# EAGLE board ARKnew (EAGLE 9.4.2)
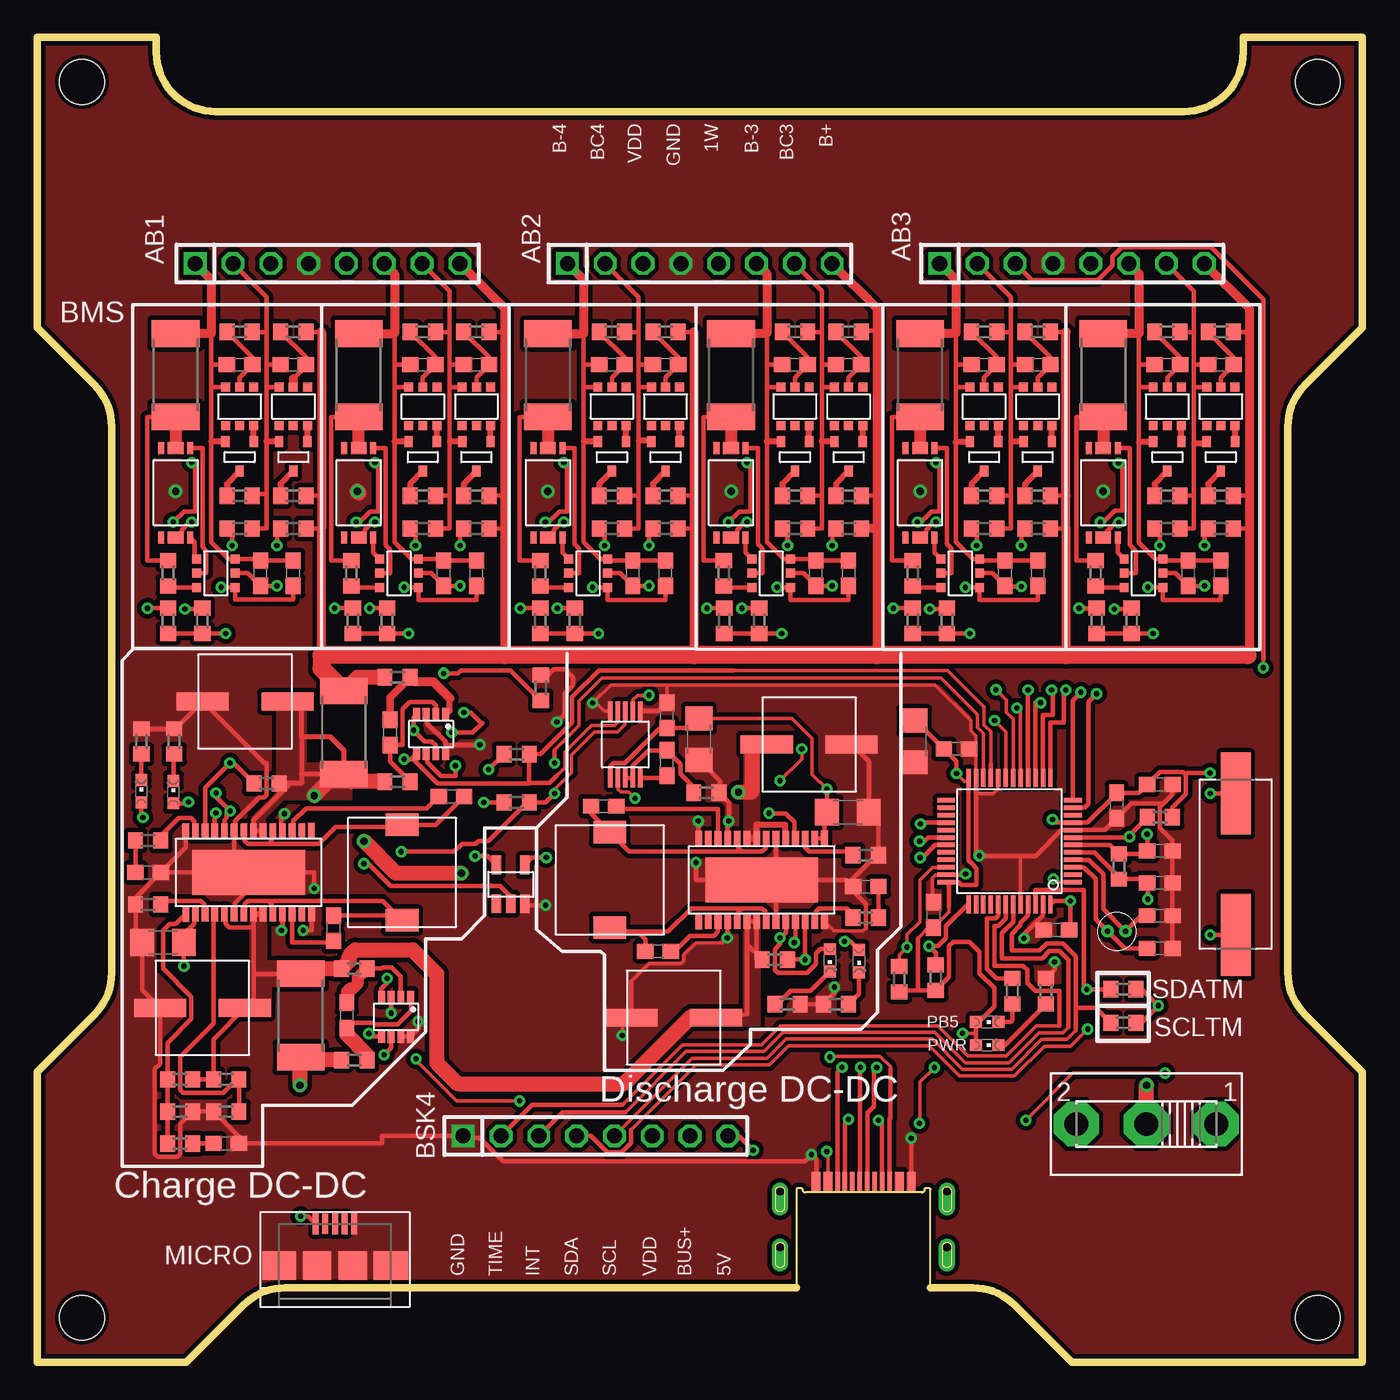
[diagram p2: board, top side]
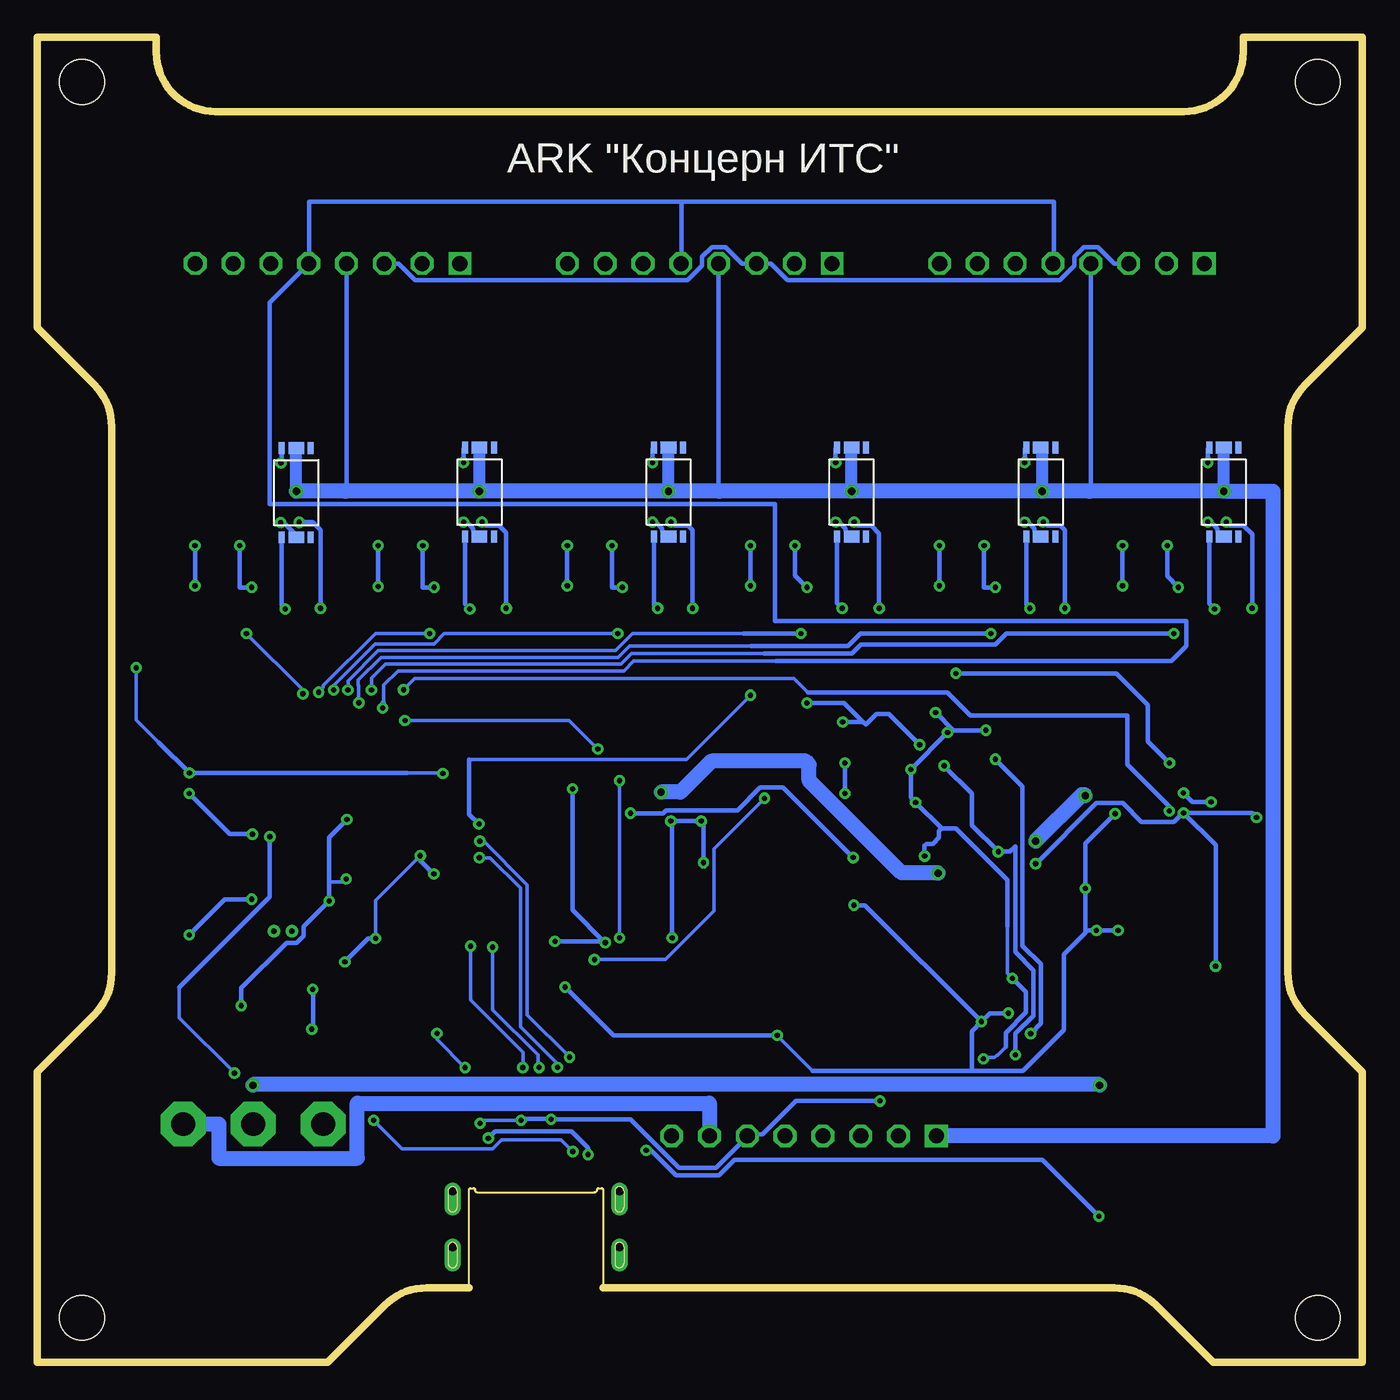
[diagram p3: board, bottom side, seen from below]

Size 89 x 89 mm. Coordinates in mm from the lower left corner, seen from the top.
Outline: 51,5 16.66,5 arc45 13.83,3.83 10,0 0,0 0,19.5 3.83,23.33 arc45 5,26.16 5,62.84 arc45 3.83,65.67 0,69.5 0,89 8,89 8,88 arc90 12,84 77,84 arc90 81,88 81,89 89,89 89,69.5 85.17,65.67 arc45 84,62.84 84,26.16 arc45 85.17,23.33 89,19.5 89,0 69.5,0 65.67,3.83 arc45 62.84,5 60,5
Copper layers (1*16): Top 0.035mm / dielectric 1.5mm / Bottom 0.035mm
Design rules "default *": minimum track width 0.25mm, minimum drill 0.35mm, track to track 0.2mm, track to pad 0.2mm, pad to pad 0.2mm, via to via 0.2mm, smd to smd 0.2mm, copper to edge 0.25mm, drill to drill 0.1mm, minimum pad ring 10mil, minimum via ring 8mil, stop-mask expansion 2mil, vias tented up to drill 0mil, thermal gap 10mil
Holes 3 mm at 3,3 86,3 86,86 3,86

## Footprints (pad centres in the part's own frame; a part is rotated, then mirrored left to right if it is on the bottom)
B82472G6 = smd 1.5 x 2.2: 1 -3.2,0; 2 3.2,0
1X08 = drill 1.016 square: 1 -8.89,0 | drill 1.016 octagon: 2 -6.35,0; 3 -3.81,0; 4 -1.27,0; 5 1.27,0; 6 3.81,0; 7 6.35,0; 8 8.89,0
AD5272 = smd 0.3 x 1.275: 1 -1,-2.24; 2 -0.5,-2.24; 3 0,-2.24; 4 0.5,-2.24; 5 1,-2.24; 6 1,2.24; 7 0.5,2.24; 8 0,2.24; 9 -0.5,2.24; 10 -1,2.24
C0603 = smd 1.1 x 1: 1 -0.85,0; 2 0.85,0
C005R = drill 0.35 pad 0.85: P$1 0,0.6; P$2 0,-0.6
C1206 = smd 1.6 x 1.8: 1 -1.4,0; 2 1.4,0
ECAP150 = smd 1.2 x 3.5: P$1 0,2.85; P$2 0,-2.85
ECAP220 = smd 1.2 x 3.5: P$1 0,2.85; P$2 0,-2.85
LQFP48 = smd 0.3 x 1.2: 1 -2.75,-4.25; 2 -2.25,-4.25; 3 -1.75,-4.25; 4 -1.25,-4.25; 5 -0.75,-4.25; 6 -0.25,-4.25; 7 0.25,-4.25; 8 0.75,-4.25; 9 1.25,-4.25; 10 1.75,-4.25; 11 2.25,-4.25; 12 2.75,-4.25; 25 2.75,4.25; 26 2.25,4.25; 27 1.75,4.25; 28 1.25,4.25; 29 0.75,4.25; 30 0.25,4.25; 31 -0.25,4.25; 32 -0.75,4.25; 33 -1.25,4.25; 34 -1.75,4.25; 35 -2.25,4.25; 36 -2.75,4.25 | smd 1.2 x 0.3: 13 4.25,-2.75; 14 4.25,-2.25; 15 4.25,-1.75; 16 4.25,-1.25; 17 4.25,-0.75; 18 4.25,-0.25; 19 4.25,0.25; 20 4.25,0.75; 21 4.25,1.25; 22 4.25,1.75; 23 4.25,2.25; 24 4.25,2.75; 37 -4.25,2.75; 38 -4.25,2.25; 39 -4.25,1.75; 40 -4.25,1.25; 41 -4.25,0.75; 42 -4.25,0.25; 43 -4.25,-0.25; 44 -4.25,-0.75; 45 -4.25,-1.25; 46 -4.25,-1.75; 47 -4.25,-2.25; 48 -4.25,-2.75
INA219AID = smd 0.9 x 0.45: 1 -1.3,0.975; 2 -1.3,0.325; 3 -1.3,-0.325; 4 -1.3,-0.975; 5 1.3,-0.975; 6 1.3,-0.325; 7 1.3,0.325; 8 1.3,0.975
CHIPLED_0603 = smd 0.8 x 0.8: A 0,-0.75; C 0,0.75
629105136821 = smd 0.4 x 1.4: 5V -1.3,0; D+ 0,0; GND 1.3,0; SENSE 0.65,0 | smd 0.4 x 1.35: D- -0.65,0 | smd 2.3 x 1.9: Z1 -3.75,-2.8; Z4 3.75,-2.8 | smd 1.9 x 1.9: Z2 -1.2,-2.8; Z3 1.2,-2.8
XTAL_9C-8.000MEEJ-T = smd 5.5 x 2: 1 -4.75,0; 2 4.75,0
R0603 = smd 1 x 1.1: 1 -0.85,0; 2 0.85,0
R2512 = smd 1.8 x 3.2: 1 -2.8,0; 2 2.8,0
UNICS-SWITCH = drill 1.6 pad 3 octagon: 1 -4.7,0; 2 0,0; 3 4.7,0
FS8205A- = smd 0.4 x 0.8: 1 -0.975,-3; 4 0.975,-3; 5 0.975,3; 8 -0.975,3 | smd 1.05 x 0.8: 23 0,-3; 67 0,3
INVERTER = smd 0.635 x 1.27: P$1 -0.95,-1.3; P$2 0,-1.3; P$3 0.95,-1.3; P$4 0.95,1.3; P$5 -0.95,1.3
HY2120 = smd 0.6 x 0.6: 1 -0.95,-1.3; 2 0,-1.3; 3 0.95,-1.3; 4 0.95,1.3; 5 0,1.3; 6 -0.95,1.3
HY2213 = smd 0.6 x 0.6: 1 -0.95,-1.3; 2 0,-1.3; 3 0.95,-1.3; 4 0.95,1.3; 5 0,1.3; 6 -0.95,1.3
SI2302CDS = smd 0.56 x 0.73: 1 -0.95,-1; 2 0.95,-1; 3 0,1
LTC3119 = smd 0.45 x 1.05: 1 -4.225,-2.775; 2 -3.575,-2.775; 3 -2.925,-2.775; 4 -2.275,-2.775; 5 -1.625,-2.775; 6 -0.975,-2.775; 7 -0.325,-2.775; 8 0.325,-2.775; 9 0.975,-2.775; 10 1.625,-2.775; 11 2.275,-2.775; 12 2.925,-2.775; 13 3.575,-2.775; 14 4.225,-2.775; 15 4.225,2.775; 16 3.575,2.775; 17 2.925,2.775; 18 2.275,2.775; 19 1.625,2.775; 20 0.975,2.775; 21 0.325,2.775; 22 -0.325,2.775; 23 -0.975,2.775; 24 -1.625,2.775; 25 -2.275,2.775; 26 -2.925,2.775; 27 -3.575,2.775; 28 -4.225,2.775 | smd 7.56 x 3.05: 29 0,0
USB-C = smd 0.3 x 1.4: 3V3/BUS0 -1.25,7.1; 3V3/BUS1 1.25,7.1; NC/3V3 -0.75,7.1; NC/M1 0.75,7.1; RX0 -1.75,7.1; SWC/TXD 0.25,7.1; SWD/RXD -0.25,7.1; TX0 1.75,7.1 | smd 0.6 x 1.4: GND0 -3.2,7.1; GND1 3.2,7.1; NC/GPIO 2.4,7.1; NRST/EN -2.4,7.1 | drill 0.6 pad 1.1 offset: P$13 -5.6,6.5; P$14 -5.6,2.75; P$15 5.6,6.5; P$16 5.6,2.75

## Placement (x,y rotation side)
3,3µH  3,3µ  [B82472G6]  24.5,32.9 270 top
3,3µH1  3,3µ  [B82472G6]  38.45,32.4 90 top
AB1  [1X08]  19.5,73.8 0 top
AB2  [1X08]  44.5,73.8 0 top
AB3  [1X08]  69.5,73.8 0 top
AD5272#2  AD5272  [AD5272]  39.5,41.5 0 top
BSK4  [1X08]  37.5,15.2 0 top
C1  0,1µ  [C0603]  27.3,53 90 top
C2  0,1µ  [C0603]  29.5,53 90 top
C3  0,1µ  [C0603]  29.5,67 180 top
C4  0,1µ  [C0603]  25.9,67 180 top
C5  0,1µ  [C0603]  52.3,53 90 top
C005R  32,768KHz  [C005R]  72.5,28.95 90 top
C6  0,1µ  [C0603]  54.5,53 90 top
C7  0,1µ  [C0603]  54.5,67 180 top
C8  0,1µ  [C0603]  50.9,67 180 top
C9  0,1µ  [C0603]  77.3,53 90 top
C10  0,1µ  [C0603]  79.5,53 90 top
C11  0,1µ  [C0603]  79.5,67 180 top
C12  0,1µ  [C0603]  75.9,67 180 top
C13  0,1µ  [C0603]  38.05,37.35 0 top
C14  0,1µ  [C0603]  41.7,27.6 0 top
C15  100nF  [C0603]  61.75,41.2 0 top
C16  10µ  [C1206]  58.9,41.7 270 top
C17  0,1µ  [C0603]  65,53 90 top
C18  0,1µ  [C0603]  67.2,53 90 top
C19  0,1µ  [C0603]  67.2,67 180 top
C20  0,1µ  [C0603]  63.6,67 180 top
C21  0,1µ  [C0603]  40,53 90 top
C22  0,1µ  [C0603]  42.2,53 90 top
C23  0,1µ  [C0603]  42.2,67 180 top
C24  0,1µ  [C0603]  38.6,67 180 top
C25  0,1µ  [C0603]  15,53 90 top
C26  0,1µ  [C0603]  17.2,53 90 top
C27  0,1µ  [C0603]  17.2,67 180 top
C28  0,1µ  [C0603]  13.6,67 180 top
C29  1µ  [C0603]  42.3,40.25 90 top
C30  680p  [C0603]  55.65,31.95 180 top
C31  4.7µ  [C1206]  54.45,36.95 0 top
C33  0,1µ  [C0603]  19.9,29.15 270 top
C34  0,1µ  [C0603]  27.82,38.01 180 top
C35  150µ  [ECAP150]  13.96,44.38 270 top
C36  680p  [C0603]  7.45,32.9 0 top
C37  220µ  [ECAP220]  11.1,23.8 270 top
C38  3,3n  [C0603]  12.7,14.7 0 top
C39  4.7µ  [C1206]  8.45,28.2 180 top
C40  0,1µ  [C0603]  20.8,23.3 90 top
C41  0,1µ  [C0603]  23.7,42.3 270 top
C44  27pF  [C0603]  75.4,34.35 0 top
C45  27pF  [C0603]  75.4,32.2 0 top
C46  10pF  [C0603]  75.4,27.8 0 top
C47  10pF  [C0603]  75.4,30 0 top
C48  100nF  [C0603]  75.4,38.8 0 top
C49  150µ  [ECAP150]  42.75,23.15 270 top
C50  220µ  [ECAP220]  51.85,41.5 90 top
C51  0,1µ  [C0603]  42.3,43.45 90 top
C52  10µ  [C1206]  44.45,41.85 270 top
C53  100nF  [C0603]  68.45,29.05 180 top
C54  100nF  [C0603]  72.5,37.4 270 top
C55  100nF  [C0603]  60.2,30.05 90 top
IC2  STM32F103C8T  [LQFP48]  65.3,35 90 top
INA219#1  INA219AID  [INA219AID]  24.1,23.2 270 top
LED1  [CHIPLED_0603]  55.2,26.95 180 top
LED2  [CHIPLED_0603]  9.15,38.3 0 top
LED3  [CHIPLED_0603]  53.25,27 180 top
LED8  [CHIPLED_0603]  7,38.35 0 top
MICRO  629105136821  [629105136821]  20,9.3 0 top
PB5  [CHIPLED_0603]  63.8,22.85 270 top
PWR  [CHIPLED_0603]  63.8,21.3 270 top
Q5  8MHz  [XTAL_9C-8.000MEEJ-T]  80.5,33.45 270 top
R1  2k  [R0603]  21.1,53 90 top
R2  330R  [R0603]  29.5,56 0 top
R3  330R  [R0603]  25.9,56 0 top
R4  100R  [R0603]  29.5,58.2 0 top
R5  100R  [R0603]  25.9,58.2 0 top
R6  100R  [R0603]  29.5,69.2 0 top
R7  100R  [R0603]  25.9,69.2 0 top
R8  R05  [R2512]  21.6,66.3 90 top
R9  2k  [R0603]  46.1,53 90 top
R10  330R  [R0603]  54.5,56 0 top
R11  330R  [R0603]  50.9,56 0 top
R12  100R  [R0603]  54.5,58.2 0 top
R13  100R  [R0603]  50.9,58.2 0 top
R14  100R  [R0603]  54.5,69.2 0 top
R15  100R  [R0603]  50.9,69.2 0 top
R16  R05  [R2512]  46.6,66.3 90 top
R17  2k  [R0603]  71.1,53 90 top
R18  330R  [R0603]  79.5,56 0 top
R19  330R  [R0603]  75.9,56 0 top
R20  100R  [R0603]  79.5,58.2 0 top
R21  100R  [R0603]  75.9,58.2 0 top
R22  100R  [R0603]  79.5,69.2 0 top
R23  100R  [R0603]  75.9,69.2 0 top
R24  R05  [R2512]  71.6,66.3 90 top
R25  5k1  [R0603]  72.95,22.8 180 top
R26  5k1  [R0603]  72.95,25.05 180 top
R27  10k  [R0603]  60.35,25.83 90 top
R28  150k  [R0603]  55.65,34.05 180 top
R29  150k  [R0603]  55.65,29.85 0 top
R30  14K3  [R0603]  44.95,38.25 0 top
R31  2k  [R0603]  53.65,24.05 0 top
R32  2k  [R0603]  9.2,41.7 270 top
R33  2k  [R0603]  58.8,53 90 top
R34  330R  [R0603]  67.2,56 0 top
R35  330R  [R0603]  63.6,56 0 top
R36  100R  [R0603]  67.2,58.2 0 top
R37  100R  [R0603]  63.6,58.2 0 top
R38  100R  [R0603]  67.2,69.2 0 top
R39  100R  [R0603]  63.6,69.2 0 top
R40  R05  [R2512]  59.3,66.3 90 top
R41  2k  [R0603]  33.8,53 90 top
R42  330R  [R0603]  42.2,56 0 top
R43  330R  [R0603]  38.6,56 0 top
R44  100R  [R0603]  42.2,58.2 0 top
R45  100R  [R0603]  38.6,58.2 0 top
R46  100R  [R0603]  42.2,69.2 0 top
R47  100R  [R0603]  38.6,69.2 0 top
R48  R05  [R2512]  34.3,66.3 90 top
R49  2k  [R0603]  8.8,53 90 top
R50  330R  [R0603]  17.2,56 0 top
R51  330R  [R0603]  13.6,56 0 top
R52  100R  [R0603]  17.2,58.2 0 top
R53  100R  [R0603]  13.6,58.2 0 top
R54  100R  [R0603]  17.2,69.2 0 top
R55  100R  [R0603]  13.6,69.2 0 top
R56  R05  [R2512]  9.3,66.3 90 top
R57  2k  [R0603]  50.4,24.05 180 top
R61  91K  [R0603]  49.55,27.05 180 top
R62  232k  [R0603]  12.7,16.85 0 top
R64  10k  [R0603]  57.9,25.73 90 top
R65  1M  [R0603]  9.6,19 0 top
R66  10k  [R0603]  9.6,14.7 180 top
R67  150k  [R0603]  9.6,16.85 180 top
R68  150k  [R0603]  7.45,30.75 0 top
R69  150k  [R0603]  7.45,35.05 180 top
R70  24k3  [R0603]  33.82,45.31 90 top
R71  R01  [R2512]  17.7,23.3 270 top
R72  232k  [R0603]  15.41,38.88 0 top
R73  10R  [R0603]  21.3,20.3 0 top
R74  10R  [R0603]  21.3,26.45 0 top
R75  R01  [R2512]  20.6,42.3 90 top
R76  10R  [R0603]  24.2,46 0 top
R77  10R  [R0603]  24.2,39 0 top
R78  1M  [R0603]  72.65,33.3 270 top
R79  10k  [R0603]  75.4,36.6 180 top
R81  2k  [R0603]  65.5,24.93 270 top
R82  2k  [R0603]  67.75,24.93 270 top
R87  680k  [R0603]  12.7,19 180 top
R88  100R  [R0603]  58.8,49.8 90 top
R89  100R  [R0603]  61.1,49.8 90 top
R90  100R  [R0603]  71.15,49.8 90 top
R91  100R  [R0603]  73.5,49.8 90 top
R92  100R  [R0603]  46.15,49.8 90 top
R93  100R  [R0603]  48.5,49.8 90 top
R94  100R  [R0603]  21.2,49.8 90 top
R95  100R  [R0603]  23.5,49.8 90 top
R96  100R  [R0603]  33.8,49.8 90 top
R97  100R  [R0603]  36.1,49.8 90 top
R98  100R  [R0603]  8.8,49.8 90 top
R99  100R  [R0603]  11.1,49.8 90 top
R100  2k  [R0603]  7,41.7 270 top
R101  5k1  [R0603]  32.2,40.85 0 top
R102  5k1  [R0603]  32.2,37.6 0 top
S1  [UNICS-SWITCH]  74.5,16 180 top
U$1  FS8205A-  [FS8205A-]  9.3,58.4 0 top
U$2  INVERTER  [INVERTER]  31.8,32.1 0 top
U$3  HY2120  [HY2120]  24.3,53 270 top
U$4  HY2213  [HY2213]  29.5,64.2 180 top
U$5  HY2213  [HY2213]  25.9,64.2 180 top
U$6  SI2302CDS  [SI2302CDS]  29.5,60.85 180 top
U$7  SI2302CDS  [SI2302CDS]  25.9,60.85 180 top
U$8  FS8205A-  [FS8205A-]  34.3,58.4 0 top
U$9  FS8205A-  [FS8205A-]  71.6,58.41 180 bottom
U$10  HY2120  [HY2120]  49.3,53 270 top
U$11  HY2213  [HY2213]  54.5,64.2 180 top
U$12  HY2213  [HY2213]  50.9,64.2 180 top
U$13  SI2302CDS  [SI2302CDS]  54.5,60.85 180 top
U$14  SI2302CDS  [SI2302CDS]  50.9,60.85 180 top
U$15  FS8205A-  [FS8205A-]  59.3,58.4 0 top
U$16  LTC3119  [LTC3119]  48.65,32.4 0 top
U$17  HY2120  [HY2120]  74.3,53 270 top
U$18  HY2213  [HY2213]  79.5,64.2 180 top
U$19  HY2213  [HY2213]  75.9,64.2 180 top
U$20  SI2302CDS  [SI2302CDS]  79.5,60.85 180 top
U$21  SI2302CDS  [SI2302CDS]  75.9,60.85 180 top
U$22  FS8205A-  [FS8205A-]  59.3,58.45 180 bottom
U$23  USB-C  [USB-C]  55.5,5 0 top
U$24  FS8205A-  [FS8205A-]  71.6,58.4 0 top
U$25  FS8205A-  [FS8205A-]  46.6,58.4 0 top
U$26  FS8205A-  [FS8205A-]  21.6,58.4 0 top
U$27  FS8205A-  [FS8205A-]  46.6,58.45 180 bottom
U$28  FS8205A-  [FS8205A-]  34.3,58.45 180 bottom
U$29  FS8205A-  [FS8205A-]  21.6,58.45 180 bottom
U$30  FS8205A-  [FS8205A-]  9.3,58.45 180 bottom
U$31  HY2120  [HY2120]  62,53 270 top
U$32  HY2213  [HY2213]  67.2,64.2 180 top
U$33  HY2213  [HY2213]  63.6,64.2 180 top
U$34  SI2302CDS  [SI2302CDS]  67.2,60.85 180 top
U$35  SI2302CDS  [SI2302CDS]  63.6,60.85 180 top
U$38  HY2120  [HY2120]  37,53 270 top
U$39  HY2213  [HY2213]  42.2,64.2 180 top
U$40  HY2213  [HY2213]  38.6,64.2 180 top
U$41  SI2302CDS  [SI2302CDS]  42.2,60.85 180 top
U$42  SI2302CDS  [SI2302CDS]  38.6,60.85 180 top
U$45  HY2120  [HY2120]  12,53 270 top
U$46  HY2213  [HY2213]  17.2,64.2 180 top
U$47  HY2213  [HY2213]  13.6,64.2 180 top
U$48  SI2302CDS  [SI2302CDS]  17.2,60.85 180 top
U$49  SI2302CDS  [SI2302CDS]  13.6,60.85 180 top
U$57  INA219AID  [INA219AID]  26.45,42.2 270 top
U$59  LTC3119  [LTC3119]  14.2,32.9 180 top

## Tracks (layer width: path | path; a pad name or v marks a point on that pad's centre or on a via)
1W  (via drill 0.35)
  Top 0.25: v65.8,43.95 66.05,43.7 IC2.17
  Bottom 0.25: 39.37,47.1 48.95,47.1 49.6,46.45 64.75,46.45 65.72,45.48 65.72,44.32
  Bottom 0.3: 45.72,77.95 45.72,73.85 AB2.5 | 45.72,77.95 70.72,77.95 70.72,73.85 AB3.5 73.4,71.17 73.4,57.65 39.45,57.65 39.45,49.78 11.82,49.78 11.82,48.12 12.84,47.1 39.37,47.1 | 45.72,77.95 20.72,77.95 20.72,73.85 AB1.5 | v65.8,43.95 65.8,44.32 65.72,44.32
5V  (via drill 0.35)
  Top 0.3: BSK4.8 47.12,15.2 v48.09,14.23 | v17.7,9.8 18.2,9.8 MICRO.5V
  Bottom 0.3: v48.09,14.23 47.77,14.23 46.09,12.55 43.22,12.55 42.17,13.6 21.5,13.6 v17.7,9.8
90
  Top 0.3: R66.2 R67.2 R65.1 8.75,21.45 10.35,23.05 10.35,24.55 8.45,26.45 8.45,29 8.9,29.45 9.3,29.45 U$59.15
A  (via drill 0.35)
  Top 0.3: U$59.16 10.55,30.05 10.55,29.46 9.85,28.76 C39.1 v9.85,26.6 | U$59.11 11.93,36.82 v12,36.9 | v21.94,33.49 22.26,33.49 23.75,32 31.1,32 31.8,31.3 U$2.P$2 | v7.1,36.6 7,36.7 LED8.A
  Bottom 0.3: v12,36.9 9.85,34.75 v9.85,26.6 | v12,36.9 12.06,36.9 12.66,36.31 14.82,36.31 16.09,37.58 17.85,37.58 v21.94,33.49 | v12,36.9 7.4,36.9 v7.1,36.6
B-1
  Top 0.3: 24,69.1 24,67 | 24,67 24,65.5 | 24,65.5 24,61.85 24,55.1 25.15,53.95 U$3.6 27.2,53.95 C1.2 C2.2 | C4.2 24,67 | U$5.3 24,65.5
  Top 0.4: U$7.2 24,61.85
  Top 0.6: AB1.6 24,73.11 24,69.1 R8.2
B-2
  Top 0.3: 11.7,69.1 11.7,67 | 11.7,67 11.7,65.5 | 11.7,65.5 11.7,61.85 11.7,55.1 12.85,53.95 U$45.6 14.9,53.95 C25.2 C26.2 | 11.7,67 C28.2 | U$47.3 11.7,65.5
  Top 0.4: U$49.2 11.7,61.85
  Top 0.6: AB1.1 11.7,72.71 11.7,69.1 R56.2
B-3
  Top 0.3: 49,69.1 49,67 | C8.2 49,67 | 49,67 49,65.5 | 49,65.5 U$12.3 | 49,65.5 49,61.85 49,55.1 50.15,53.95 U$10.6 52.2,53.95 C5.2 C6.2
  Top 0.4: U$14.2 49,61.85
  Top 0.6: AB2.6 49,73.11 49,69.1 R16.2
B-4
  Top 0.3: 36.7,69.1 36.7,67 | 36.7,67 36.7,65.5 | 36.7,65.5 36.7,61.85 36.7,55.1 37.85,53.95 U$38.6 38.4,53.85 C21.2 C22.2 | C24.2 36.7,67 | U$40.3 36.7,65.5
  Top 0.4: U$42.2 36.7,61.85
  Top 0.6: AB2.1 36.7,72.71 36.7,69.1 R48.2
B-5
  Top 0.3: 74,69.1 74,67 | C12.2 74,67 | 74,67 74,65.5 | 74,65.5 U$19.3 | 74,65.5 74,61.8 74,55.05 75.1,53.95 U$17.6 75.6,53.85 C9.2 C10.2
  Top 0.4: U$21.2 74.9,61.8 74,61.8
  Top 0.6: AB3.6 74,73.11 74,69.1 R24.2
B-6
  Top 0.3: 61.7,69.1 61.7,67 | 61.7,67 C20.2 | 61.7,67 61.7,65.5 | 61.7,65.5 U$33.3 | 61.7,65.5 61.7,61.8 61.7,55.1 62.85,53.95 U$31.6 63.3,53.85 C17.2 C18.2
  Top 0.4: U$35.2 62.6,61.8 61.7,61.8
  Top 0.6: AB3.1 61.7,72.71 61.7,69.1 R40.2
BMS1  (via drill 0.35)
  Top 0.3: R94.1 R95.1 v24.95,48.95 | IC2.15 67.05,44.3 v67.4,44.3
  Bottom 0.25: 41.05,48.1 49.22,48.1 49.97,47.35 65.92,47.35 67.43,45.83 67.43,45.45 67.42,45.44 67.42,44.33 v67.4,44.3
  Bottom 0.3: v24.95,48.95 33.7,48.95 34.55,48.1 41.05,48.1
BMS2  (via drill 0.35)
  Top 0.3: R98.1 R99.1 v12.65,48.95 | IC2.16 v66.55,45.15
  Bottom 0.25: 40.2,47.6 49.08,47.6 49.79,46.9 65.6,46.9 66.55,45.95 v66.55,45.15
  Bottom 0.3: v12.65,48.95 23.92,48.95 24.65,48.22 33.67,48.22 34.29,47.6 40.2,47.6
BMS3  (via drill 0.35)
  Top 0.3: R92.1 R93.1 v50,48.95 | IC2.13 68.05,42.97 68.96,42.97 68.96,45.15 v69.08,45.15
  Bottom 0.25: v50,48.95 61.66,48.95 62.36,48.25 66.3,48.25 69.08,45.47 v69.08,45.15
BMS4  (via drill 0.35)
  Top 0.3: R96.1 R97.1 v37.7,48.95 | IC2.14 67.55,43.47 68.23,43.47 68.23,45.13 68.13,45.13 v68.13,45.15
  Bottom 0.25: 41.55,48.95 49.01,48.95 50.16,47.8 66.1,47.8 68.13,45.77 v68.13,45.15
  Bottom 0.3: v37.7,48.95 41.55,48.95
BMS5  (via drill 0.35)
  Top 0.3: R90.1 R91.1 v74.95,48.95 | IC2.11 70.35,37.25 70.6,37.5 70.6,44.35 v71.15,44.9
  Bottom 0.25: v74.95,48.95 71.15,45.15 v71.15,44.9
BMS6  (via drill 0.35)
  Top 0.3: R88.1 R89.1 v62.65,48.95 | v70.1,45 69.55,44.45 IC2.12
  Bottom 0.25: v70.1,45 69.79,45.31 69.79,45.44 66.28,48.95 v62.65,48.95
BMS+
  Top 0.3: R54.2 19.1,69.2 | R52.2 19.1,58.2 | R50.2 19.1,56 | R2.2 31.4,56 | R4.2 31.4,58.2 | R6.2 31.4,69.2 | 44.1,56 R42.2 | R46.2 44.1,69.2 | R44.2 44.1,58.2 | R12.2 56.4,58.2 | R14.2 55.45,69.3 56.4,69.3 | 81.4,56 R18.2 | R20.2 81.4,58.2 | R22.2 81.4,69.2 | R34.2 69.1,56 | R36.2 69.1,58.2 | R38.2 69.1,69.2
  Top 0.6: 19.1,69.2 19.1,58.2 19.1,56 19.1,47.5 | AB1.8 31.4,70.79 31.4,69.2 31.4,58.2 31.4,56 31.4,47.5 | 44.1,69.2 44.1,58.2 44.1,56 44.1,47.5 | AB2.8 56.4,70.79 56.4,69.3 56.4,58.2 56.4,56 | 56.4,56 R10.2 | 69.1,69.2 69.1,58.2 69.1,56 69.1,47.5 | AB3.8 81.4,70.79 81.4,69.2 81.4,58.2 81.4,56 81.4,47.6 81.3,47.5 | 56.4,56 56.4,47.5
  Top 1: R76.1 21.5,46 R75.2
  Top 1.2: 81.3,47.5 69.1,47.5 56.4,47.5 44.1,47.5 31.4,47.5 19.1,47.5 19.1,46.6 R75.2
BUS+  (via drill 0.5)
  Top 1: R73.1 17.9,20.3 R71.2 17.65,20.5 v17.65,18.6 | S1.2 v74.5,18.6
  Bottom 1: v74.5,18.6 74.4,18.7 17.75,18.7 v17.65,18.6
BUSPLUS
  Bottom 1: S1.1 76.8,16 76.8,13.7 67.5,13.7 67.5,17.4 43.85,17.4 BSK4.7
DPD_RST  (via drill 0.35)
  Top 0.25: AD5272#2.7 40.02,43.77 40.02,44.51 40.31,44.8 v41.1,44.8
  Top 0.3: v59.33,36.15 59.43,36.25 IC2.28
  Bottom 0.25: 59.98,40.5 45.4,40.5 v41.1,44.8
  Bottom 0.3: 59.98,40.5 59.98,36.8 v59.33,36.15
GND  (via drill 0.35, 0.5)
  Top 0.25: IC2.23 63.05,39.27 63.05,39.28 63.05,42.08 62.7,42.44 62.7,43.1 60.3,45.5 42.3,45.5 | 42.3,45.5 38.52,45.5 v37.3,44.27 37.55,44.27 38.09,43.74 AD5272#2.10 | C51.2 42.3,45.5 | v46.35,28.5 46.02,28.18 44.25,28.18 43.42,27.35 43.42,26.96 43.23,26.77 41.1,26.77 39.9,25.57 | v39.3,21.95 39.3,22.55 | IC2.20 64.53,39.23 64.53,38.52 64.21,38.2 63.05,38.2 | IC2.44 66.05,33.98 66.1,34.02 | 61.2,32.75 61.17,32.73 60.31,32.73 60.12,32.53 60.12,30.98 C55.2 | 55.65,29.16 55.62,29.16 55.44,28.98 53.52,28.98 U$16.14
  Top 0.3: C46.2 C47.2 C45.2 C44.2 76.25,35.05 75.4,35.91 75.4,37.3 75.65,37.55 | C48.2 76.25,38.15 75.65,37.55 | 75.65,37.55 73.5,37.55 C54.2 | C54.2 71.7,35.75 IC2.8 68.81,35.75 67.08,34.02 66.1,34.02 v63.27,34.02 63.05,34.25 63.05,38.2 IC2.23 | U$59.29 13.22,33.88 U$59.9 13.3,35.75 13.3,36.34 14.9,37.95 15.26,37.95 15.41,38.1 15.41,40.25 15.24,40.25 C35.P$2 9.28,42.55 R32.1 R100.1 | U$59.14 9.97,34.58 C36.2 | C36.2 U$59.29 | U$59.20 13.3,30.2 13.3,30.85 14.2,31.75 U$59.29 | C36.2 6.6,31.2 R68.1 6.6,28.65 C39.2 7.05,25 C37.P$2 8.25,20.05 7.9,19.7 7.9,14.01 8.11,13.8 9.39,13.8 9.6,14.01 9.6,16 R67.1 R62.1 13.55,15.15 C38.2 23.18,14.7 23.18,15.2 BSK4.1 28.8,15.07 29.7,15.07 31.27,13.5 51.55,13.5 v52,13.95 52.34,13.62 52.34,12.11 U$23.GND0 | U$59.25 16.48,29.08 v16.4,29 | U$59.28 18.43,29 v17.85,29 | U$59.29 18.6,32.9 v18.6,31.83 | U$59.4 16.4,35.75 16.4,36.65 v16.6,36.85 | C51.2 41.74,43.74 AD5272#2.6 | U$16.20 49.62,33.38 U$16.29 | U$16.9 49.62,31.43 U$16.29 | 54.35,32.4 U$16.29 | U$16.4 46.38,28.52 v46.35,28.5 | U$16.25 46.38,36.27 v46.45,36.35 46.45,37.6 45.85,38.2 | U$16.28 44.42,36.33 v44.4,36.35 | U$16.29 44.25,32.4 v44.25,33.55 | U$23.GND1 58.73,12.15 58.73,15.03 v58.7,15.05 | IC2.35 61.2,32.75 62.31,32.75 v62.36,32.8 | R82.1 68.34,26.37 v68.34,26.89 | IC2.47 67.55,30 66.28,28.73 v66.28,28.47 | 45.85,38.2 R30.2 | C52.2 45.85,39.05 45.85,38.2 | C54.2 | v34.9,43 35.42,43.52 35.42,44.88 36,45.46 36,46 35.45,46.55 34.7,46.55 34.31,46.16 R70.2 | v25.57,22.88 25.57,22.4 INA219#1.8 INA219#1.7 | INA219#1.3 v23.77,23.46 v23.77,23.45 | U$57.3 26.2,43.42 26.2,42.91 27.43,41.68 27.43,41.47
  Top 0.3: v29.72,41.47 27.43,41.47 | v34.15,30.7 32.85,30.7 U$2.P$3 | C50.P$2 55.85,40.35 C31.2 56.5,36.3 R28.1 56.35,34.05 54.6,32.3 54.6,32.15 C30.2 54.7,31.84 54.6,31.84 55.65,30.8 55.65,29.16 | 27.43,41.47 U$57.8 | C49.P$2 39.9,25.57 | v53.55,25.2 53.55,24.8 R31.1 R57.1
  Top 1: 21.6,58.4 v21.5,58.5
  Bottom 0.25: 36.92,19.57 v39.3,21.95 | v63.27,34.02 66.28,31.02 v66.28,28.47
  Bottom 0.3: v16.4,29 v17.85,29 18.45,29 18.6,28.85 | 18.6,28.85 v18.6,31.83 18.6,34.85 v16.6,36.85 | 18.6,28.85 20.05,27.4 20.05,22.32 22.79,19.57 26.23,19.57 | AB3.4 68.23,58.57 68.3,58.5 | AB2.4 43.23,58.53 43.2,58.5 | AB1.4 18.23,58.57 18.3,58.5 | v46.35,28.5 46.35,36.25 v46.45,36.35 v44.4,36.35 44.25,36.35 v44.25,33.55 | 26.23,19.57 36.92,19.57 | v25.57,22.88 26.23,22.23 26.23,19.57 | v62.36,32.8 63.27,33.71 v63.27,34.02 | v68.34,26.89 66.76,28.47 v66.28,28.47 | v52,13.95 52,14.4 53.1,15.5 58.25,15.5 v58.7,15.05 | 33.52,43 34.8,44.27 v37.3,44.27 | 33.52,43 33.35,42.83 32.62,43.55 31.8,43.55 v29.72,41.47 | 33.52,43 v34.9,43 | v23.77,23.45 25.01,23.45 v25.57,22.88 | v25.57,22.88 33.4,30.7 v34.15,30.7 | v39.3,21.95 50.3,21.95 v53.55,25.2
  Bottom 0.8: v71.6,58.5 U$9.23 | v59.3,58.5 U$22.23 | v46.6,58.5 U$27.23 | v34.3,58.5 U$28.23 | v21.5,58.5 21.5,61.35 U$29.23 | v9.3,58.5 U$30.23
  Bottom 1: v71.6,58.5 68.3,58.5 v59.3,58.5 v46.6,58.5 43.2,58.5 v34.3,58.5 v21.5,58.5 18.3,58.5 v9.3,58.5 6,58.5 6,15.2 BSK4.1
  pour Top (isolate 0.3, rank 2, no thermals): 0.1,89 8,89 8,87.5 8.2,87.3 8.2,86.7 8.7,86.2 8.7,85.8 10.1,84.4 10.5,84.4 10.8,84.1 78.5,84.1 79.2,84.8 79.6,84.8 80.3,85.5 80.3,85.8 80.8,86.3 80.8,86.8 81.1,87.1 81.1,88.9 81.2,89 89.1,89 89.1,69.4 84.4,64.7 84.4,64.1 84.1,63.8 84.1,25.2 84.5,24.8 84.5,24.2 89,19 89,0.2 69.4,0.2 65.2,4.4 64.7,4.4 64.3,4.8 63.8,4.8 63.6,5 15.62,5 arc45 14.65,4.6 14.6,4.6 9.9,-0.1 0.4,-0.1 0.2,0.1 0.2,19.6 4.3,23.7 4.3,23.9 4.8,24.4 4.8,24.9 5,25.1 5,64.1 4.7,64.4 4.7,64.9 0.1,69.5
I2CINT
  Top 0.25: 69.25,22.5 68.88,22.13 67.28,22.13 65.27,20.12 62.33,20.12 60.3,22.16 50.1,22.16 48.82,20.88 43.58,20.88 39.5,16.8
  Top 0.3: BSK4.3 35.29,16.8 39.5,16.8 | 69.25,22.5 69.25,27.02 68.65,27.62 68,27.62 67.52,27.14 64.8,27.14 64.8,28.84 65.55,29.59 IC2.43
INA_BMS+  (via drill 0.5)
  Top 0.3: R75.1 17.75,39.5 | U$59.6 U$59.7
  Top 0.35: U$59.7 14.53,36.42 16.98,38.88 R72.2 17.75,38.88 17.75,39.5 17.75,42 | R75.1 20.6,41.1 19.7,42 17.75,42 | 17.75,42 17.75,44.38 C35.P$1
  Top 0.4: U$16.23 U$16.22 48.3,35.17 48.3,36.1 50.25,36.1 50.25,35.17 U$16.19
  Top 1: R75.1 21.1,39 R77.1 19.54,39 v18.6,38.06 | v28.5,32.85 24.1,32.85 v21.95,35 | v47.1,38.3 47.95,38.3 48.01,38.36 48.01,41.5 C50.P$1
  Bottom 1: v28.5,32.85 28.52,32.87 30.95,32.87 37.15,39.08 37.15,40.15 37.38,40.38 43.72,40.38 45.79,38.3 v47.1,38.3 | v21.95,35 18.84,38.11 18.65,38.11 v18.6,38.06
  pour Top (no thermals): 47.45,34.65 48.55,34.65 48.55,40.9 47.45,40.9
  pour Top (no thermals): 16.05,44.85 16.05,38.25 14.4,36.6 14.4,35.3 14.45,35.25 15.35,35.25 15.35,36.55 16.6,37.8 21.15,37.8 21.15,40.25 18.1,40.25 18.1,44.85
INA_BUS+
  Top 0.3: 14.53,26.1 14.53,29.2 | 14.53,29.2 U$59.22 | R71.1 14.53,26.1 | 14.53,26.1 14.53,23.8 C37.P$1 11.85,21.7 R87.2 R65.2 | U$59.19 12.65,30.05 12.65,29.45 12.9,29.2 14.53,29.2 | 47.67,28.07 R61.2 48.33,27.05 U$16.7 U$16.6 47.67,28.07 | 47.67,28.07 47.67,23.38 45.81,23.17 C49.P$1
  Top 0.4: U$59.22 U$59.23
  Top 1: R71.1 18.05,26.45 R74.1 20.95,26.95 20.95,27.29 21.36,27.7 25.23,27.7 26.83,26.1 26.83,20.12 28.23,18.71 39.41,18.71 43.87,23.17 45.81,23.17
  pour Top (no thermals): 14.3,30.65 15.4,30.65 15.4,27 16.1,27 16.1,25.2 15.7,25.2 15.7,24.4 14.3,24.4
  pour Top (no thermals): 47.45,30.15 48.55,30.15 48.55,22.55 47.35,22.55 47.35,23.75 47.45,23.75
N$1  (via drill 0.35)
  Top 0.3: U$3.5 26.45,53 C1.1 v28.4,52.15 | R2.1 28.4,55.75 v28.4,54.85
  Bottom 0.3: v28.4,54.85 v28.4,52.15
N$2
  Top 0.3: R7.1 26.75,67.5 C4.1 25.9,66.15 U$5.2
N$3
  Top 0.3: U$3.3 21.2,52.05 R1.1
N$4
  Top 0.3: R6.1 30.35,67.5 C3.1 29.5,66.15 U$4.2
N$5  (via drill 0.35)
  Top 0.25: AD5272#2.2 39.02,39.23 39.02,38.49 39.22,38.3 39.73,38.3 v40.15,37.88
  Top 0.3: R61.1 v51.58,27.05 U$16.12
  Bottom 0.25: v40.15,37.88 43.55,34.48 43.55,30.31 46.81,27.05 v51.58,27.05
N$6
  Top 0.4: U$6.1 U$4.6
N$7
  Top 0.4: U$6.3 28.65,59 R4.1
N$8
  Top 0.3: 27.7,69.2 27.7,67 | 27.7,67 27.7,65.5 | 27.7,65.5 27.7,61.85 27.7,58.2 | 27.7,58.2 27.7,56 R3.2 | R5.2 27.7,58.2 | R7.2 27.7,69.2 | C3.2 27.7,67 | U$4.3 27.7,65.5 | AB1.7 27.7,71.95 27.7,69.2
  Top 0.4: U$6.2 27.7,61.85
N$9
  Top 0.4: U$7.1 U$5.6
N$10
  Top 0.4: U$7.3 25.05,59 R5.1
N$11
  Top 0.3: 47.3,34.3 47.1,34.51 47.1,35.1 U$16.24 | 47.3,34.3 48.7,34.3 48.9,34.51 48.9,35.1 U$16.21 | 47.3,34.3 39.75,34.3 3,3µH1.2 37.2,36.85 C13.1
N$12
  Top 0.3: 47.3,30.5 47.1,30.3 47.1,29.7 U$16.5 | 47.3,30.5 48.7,30.5 48.9,30.3 48.9,29.7 U$16.8 | 47.3,30.5 43.95,30.5 42.38,28.93 38.73,28.93 3,3µH1.1 38.75,28.9 40.35,28.9 40.85,28.4 C14.1
N$13
  Top 0.3: R1.2 19.75,53.85 19.75,63.5 R8.1
  Top 0.8: U$26.67 R8.1
N$14
  Top 0.3: INA219#1.2 24.4,24.52 24.4,25.91 23.8,26.51 23.2,26.51 23.14,26.45 R74.2
  Top 0.8: C40.2 20.8,24.9 21,25.1 21.2,25.1 21.55,25.45 21.55,25.85 R74.2
N$15  (via drill 0.35)
  Top 0.3: C2.1 29.5,51.2 25.6,51.2 U$3.4 v24.65,52.05 | R3.1 25.4,55.65 v25.4,54.85
  Bottom 0.3: v25.4,54.85 25.4,52.05 v24.65,52.05
N$16  (via drill 0.35)
  Top 0.3: R10.1 53.4,55.75 v53.4,54.85 | v53.4,52.15 C5.1 51.45,53 U$10.5
  Bottom 0.3: v53.4,54.85 v53.4,52.15
N$17
  Top 0.3: PB5.C 65.4,22.85 65.5,22.95 R81.2
N$18
  Top 0.3: U$10.3 46.2,52.05 R9.1
N$19
  Top 0.3: R14.1 55.35,67.5 C7.1 54.5,66.15 U$11.2
N$20
  Top 0.4: U$13.1 U$11.6
N$21
  Top 0.4: U$13.3 53.65,59 R12.1
N$22
  Top 0.4: U$14.1 U$12.6
N$23
  Top 0.4: U$14.3 50.05,59 R13.1
N$24
  Top 0.3: R9.2 44.75,53.85 44.75,63.5 R16.1
  Top 0.8: R16.1 U$25.67
N$25  (via drill 0.35)
  Top 0.3: v27.3,46.27 28.25,46.27 28.45,46.48 31.8,46.48 R70.1 | R72.1 13.19,40.25 v12.95,40.25 11.28,38.58 U$59.12
  Bottom 0.3: v12.95,40.25 14.4,41.7 14.4,44.16 16.52,46.27 v27.3,46.27
N$26
  Top 0.3: LED1.C 55.2,24.75 R31.2
N$27  (via drill 0.35)
  Top 0.3: R11.1 50.4,55.65 v50.4,54.85 | v49.7,52.05 U$10.4 50.6,51.2 54.5,51.2 C6.1
  Bottom 0.3: v50.4,54.85 50.4,52.05 v49.7,52.05
N$28
  Top 0.3: R15.1 51.75,67.5 C8.1 50.9,66.15 U$12.2
N$29
  Top 0.3: U$16.17 51.58,34.58 51.85,34.3 54.4,34.3 54.65,34.05 R28.2
N$30
  Top 0.3: AB2.7 52.7,71.95 52.7,69.2 | 52.7,69.2 52.7,67 | 52.7,67 52.7,65.5 | 52.7,65.5 52.7,61.85 52.7,58.2 | 52.7,58.2 52.7,56 R11.2 | R13.2 52.7,58.2 | C7.2 52.7,67 | R15.2 52.7,69.2 | U$11.3 52.7,65.5
  Top 0.4: U$13.2 52.7,61.85
N$31  (via drill 0.35)
  Top 0.3: R91.2 73.45,50.6 v72.35,50.6
  Bottom 0.3: v72.35,50.6 72.58,50.83 U$9.5
N$32
  Top 0.3: U$16.26 45.73,37.15 38.9,37.15 C13.2
N$33  (via drill 0.35)
  Top 0.3: U$17.5 76.45,53 C9.1 v78.4,52.15 | R18.1 78.4,55.75 v78.4,54.85
  Bottom 0.3: v78.4,54.85 v78.4,52.15
N$34
  Top 0.3: R17.1 71.2,52.05 U$17.3
N$35
  Top 0.3: U$18.2 79.5,66.15 C11.1 80.35,67.5 R22.1
N$36
  Top 0.4: U$18.6 U$20.1
N$37
  Top 0.4: U$20.3 78.65,59 R20.1
N$38
  Top 0.4: U$21.1 U$19.6
N$39
  Top 0.4: U$21.3 75.05,59 R21.1
N$40
  Top 0.3: R17.2 69.8,53.85 69.8,63.5 R24.1
  Top 0.8: R24.1 U$24.67
N$41
  Top 0.3: R29.1 54.8,30.1 54.4,30.5 52.51,30.5 52.3,30.3 52.3,29.7 U$16.13
N$42
  Top 0.3: R29.2 C30.1
N$43  (via drill 0.35)
  Top 0.3: C10.1 79.5,51.2 75.6,51.2 U$17.4 v74.6,52.05 | R19.1 75.4,55.65 v75.4,54.85
  Bottom 0.3: v75.4,54.85 75.4,52.05 v74.6,52.05
N$44
  Top 0.3: U$19.2 75.9,66.15 C12.1 76.75,67.5 R23.1
N$45  (via drill 0.35)
  Top 0.3: R90.2 v69.98,50.64 | v72.63,60.4 72.9,60.13 72.9,57.2 72.39,57.2 71.61,56.42 v71.4,56.42
  Bottom 0.3: v69.98,50.64 69.98,55.9 70.5,56.42 v71.4,56.42 | v72.63,60.4 72.58,60.45 U$9.4
N$46
  Top 0.3: AB3.7 77.7,71.95 77.7,69.2 | 77.7,69.2 R23.2 | 77.7,69.2 77.7,67 | C11.2 77.7,67 | 77.7,67 77.7,65.5 | 77.7,65.5 U$18.3 | 77.7,65.5 77.7,61.7 77.7,58.2 | 77.7,58.2 R21.2 | 77.7,58.2 77.7,56 R19.2
  Top 0.4: U$20.2 78.4,61.7 77.7,61.7
N$47  (via drill 0.35)
  Top 0.25: v53.05,38.5 52.05,39.5 52.05,41.91 50.71,43.25 C52.1
  Top 0.3: C52.1 43.8,42.6 C51.1 41.84,42.6 39.49,40.25 38.7,40.25 38.5,40.04 AD5272#2.1 | U$16.16 U$16.15 52.88,36.77 C31.1 v53.05,38.5 | v50.85,28.18 50.92,28.26 U$16.11 | v54.23,28.27 54.63,28.27 LED1.A
  Bottom 0.3: v53.05,38.5 53.05,30.38 v50.85,28.18 50.94,28.27 v54.23,28.27
N$48
  Top 0.3: AD5272#2.3 AD5272#2.4 40,40.04 41.06,41.1 C29.2 43.2,40.2 43.2,39.51 44.1,38.6 R30.1
N$49  (via drill 0.35)
  Top 0.3: U$15.23 59.73,55.83 59.73,55.95 60.21,56.43 v60.37,56.43
  Bottom 0.3: U$22.67 59.73,55.88 59.73,55.99 60.16,56.43 v60.37,56.43
N$50  (via drill 0.35)
  Top 0.3: v72.65,56.4 72.45,56.4 71.6,55.55 U$24.23
  Bottom 0.3: U$9.67 71.6,55.55 72.45,56.4 v72.65,56.4
N$51
  Top 0.3: C29.1 42.16,39.26 AD5272#2.5
N$52
  Top 0.3: U$16.3 45.73,28.93 45.45,28.65 43.85,28.65 42.8,27.6 C14.2
N$53  (via drill 0.35)
  Top 0.3: R88.2 v57.5,50.65 | v59.13,56.43 59.34,56.43 60.07,57.16 60.6,57.16 60.6,60.19 v60.37,60.42
  Bottom 0.3: v59.13,56.43 58.9,56.2 57.98,56.2 57.5,55.72 v57.5,50.65 | v60.37,60.42 60.37,61.35 U$22.4
N$54
  Top 0.3: LED2.C 9.15,40.8 R32.2
N$55
  Top 0.3: R62.2 R87.1 13.39,19 12.49,18.1 9.8,18.1 9.6,18.3 9.6,20.5 11.85,22.75 11.85,30.05 U$59.18
N$56
  Top 0.3: LED3.C 51.95,24.95 50.6,24.95 49.7,24.05 R57.2
N$57
  Top 0.4: U$34.3 66.35,59 R36.1
N$58
  Top 0.4: U$35.3 62.75,59 R37.1
N$59
  Top 0.4: U$41.3 41.35,59 R44.1
N$60
  Top 0.3: LED8.C R100.2
N$61  (via drill 0.35)
  Top 0.3: R89.2 61.05,50.6 v59.95,50.6
  Bottom 0.3: v59.95,50.6 60.27,50.92 U$22.5
N$62  (via drill 0.35)
  Top 0.3: U$25.23 47.02,55.83 47.02,55.95 47.51,56.43 v47.67,56.43
  Bottom 0.3: U$27.67 47.02,55.88 47.02,55.99 47.46,56.43 v47.67,56.43
N$63  (via drill 0.35)
  Top 0.3: R93.2 v47.33,50.65
  Bottom 0.3: v47.33,50.65 47.58,50.9 U$27.5
N$64  (via drill 0.35)
  Top 0.3: R92.2 v44.98,50.65 | v46.43,56.43 47.16,57.16 47.9,57.16 47.9,60.19 v47.67,60.42
  Bottom 0.3: v46.43,56.43 46.2,56.2 45.28,56.2 44.98,55.9 v44.98,50.65 | v47.67,60.42 47.67,61.35 U$27.4
N$65  (via drill 0.35)
  Top 0.3: U$31.5 64.15,53 C17.1 65,52.1 v66.1,52.1 | R34.1 66.1,55.75 v66.1,54.85
  Bottom 0.3: v66.1,54.85 v66.1,52.1
N$66
  Top 0.3: U$31.3 58.9,52.05 R33.1
N$67
  Top 0.3: U$32.2 67.2,66.15 C19.1 68.05,67.5 R38.1
N$68
  Top 0.4: U$34.1 U$32.6
N$69
  Top 0.4: U$42.3 37.75,59 R45.1
N$70
  Top 0.4: U$35.1 U$33.6
N$71
  Top 0.4: U$48.3 16.35,59 R52.1
N$72
  Top 0.3: R33.2 57.4,53.85 57.4,63.5 R40.1
  Top 0.8: R40.1 U$15.67
N$73  (via drill 0.35)
  Top 0.3: U$8.23 34.73,55.83 34.73,55.95 35.21,56.43 v35.37,56.43
  Bottom 0.3: U$28.67 34.73,55.88 34.73,55.99 35.16,56.43 v35.37,56.43
N$74  (via drill 0.35)
  Top 0.3: R97.2 v34.93,50.65
  Bottom 0.3: v34.93,50.65 35.27,51 U$28.5
N$75  (via drill 0.35)
  Top 0.3: C18.1 67.2,51.2 63.3,51.2 U$31.4 v62.35,52.05 | R35.1 63.1,55.65 v63.1,54.85
  Bottom 0.3: v63.1,54.85 63.1,52.05 v62.35,52.05
N$76
  Top 0.3: U$33.2 63.6,66.15 C20.1 64.45,67.5 R39.1
N$77  (via drill 0.35)
  Top 0.3: R96.2 v32.45,50.65 | v34.13,56.43 34.34,56.43 35.07,57.16 35.6,57.16 35.6,60.19 v35.37,60.42
  Bottom 0.3: v34.13,56.43 33.9,56.2 32.98,56.2 32.45,55.67 v32.45,50.65 | v35.37,60.42 35.37,61.35 U$28.4
N$78
  Top 0.3: AB3.2 65.4,71.55 65.4,69.2 | 65.4,69.2 65.4,67 | 65.4,67 65.4,65.5 | 65.4,65.5 65.4,61.85 65.4,58.2 | 65.4,58.2 65.4,56 R35.2 | R37.2 65.4,58.2 | C19.2 65.4,67 | U$32.3 65.4,65.5 | R39.2 65.4,69.2
  Top 0.4: U$34.2 65.4,61.85
N$79  (via drill 0.35)
  Top 0.3: U$26.23 22.02,55.83 22.02,55.95 22.51,56.43 v22.67,56.43
  Bottom 0.3: U$29.67 22.02,55.88 22.02,55.99 22.46,56.43 v22.67,56.43
N$80  (via drill 0.35)
  Top 0.3: R95.2 v22.33,50.65
  Bottom 0.3: v22.33,50.65 22.57,50.9 U$29.5
N$81  (via drill 0.35)
  Top 0.3: U$38.5 39.15,53 C21.1 v41.1,52.15 | R42.1 41.1,55.75 v41.1,54.85
  Bottom 0.3: v41.1,54.85 v41.1,52.15
N$82
  Top 0.3: U$38.3 33.9,52.05 R41.1
N$83
  Top 0.3: R46.1 43.05,67.5 C23.1 42.2,66.15 U$39.2
N$84
  Top 0.4: U$41.1 U$39.6
N$85
  Top 0.4: U$49.3 12.75,59 R53.1
N$86
  Top 0.4: U$42.1 U$40.6
N$88
  Top 0.3: R41.2 32.4,53.85 32.4,63.5 R48.1
  Top 0.8: R48.1 U$8.67
N$89  (via drill 0.35)
  Top 0.3: R94.2 v19.98,50.65 | v21.43,56.43 21.64,56.43 22.37,57.16 22.9,57.16 22.9,60.19 v22.67,60.42
  Bottom 0.3: v21.43,56.43 21.2,56.2 20.28,56.2 19.98,55.9 v19.98,50.65 | v22.67,60.42 22.67,61.35 U$29.4
N$90  (via drill 0.35)
  Top 0.3: U$1.23 9.72,55.83 9.72,55.95 10.21,56.43 v10.37,56.43
  Bottom 0.3: U$30.67 9.72,55.88 9.72,55.99 10.16,56.43 v10.37,56.43
N$91  (via drill 0.35)
  Top 0.3: R43.1 38.1,55.65 v38.1,54.85 | v37.3,52.05 U$38.4 38.3,51.2 42.2,51.2 C22.1
  Bottom 0.3: v38.1,54.85 38.1,52.85 v37.3,52.05
N$92
  Top 0.3: U$40.2 38.6,66.15 C24.1 39.45,67.5 R47.1
N$93  (via drill 0.35)
  Top 0.3: R99.2 11.05,50.6 v9.93,50.6
  Bottom 0.3: v9.93,50.6 10.28,50.95 U$30.5
N$94
  Top 0.3: AB2.2 40.4,71.55 40.4,69.2 | 40.4,69.2 40.4,67 | 40.4,67 40.4,65.5 | 40.4,65.5 40.4,61.9 40.4,58.2 | 40.4,58.2 40.4,56 R43.2 | R45.2 40.4,58.2 | U$39.3 40.4,65.5 | C23.2 40.4,67 | R47.2 40.4,69.2
  Top 0.4: U$41.2 41.2,61.9 40.4,61.9
N$95  (via drill 0.35)
  Top 0.3: R98.2 v7.4,50.65 | v9.13,56.43 9.86,57.16 10.6,57.16 10.6,60.19 v10.37,60.42
  Bottom 0.3: v9.13,56.43 8.9,56.2 7.98,56.2 7.4,55.62 v7.4,50.65 | v10.37,60.42 10.37,61.35 U$30.4
N$97  (via drill 0.35)
  Top 0.3: U$45.5 14.15,53 C25.1 v16.1,52.15 | R50.1 16.1,55.75 v16.1,54.85
  Bottom 0.3: v16.1,54.85 v16.1,52.15
N$98
  Top 0.3: U$45.3 8.9,52.05 R49.1
N$99
  Top 0.3: R54.1 18.05,67.5 C27.1 18.05,66.9 17.2,66.05
  Top 0.6: 17.2,66.05 U$46.2
N$100
  Top 0.4: U$48.1 U$46.6
N$102
  Top 0.4: U$49.1 U$47.6
N$104
  Top 0.3: R49.2 7.4,53.85 7.4,63.5 R56.1
  Top 0.8: R56.1 U$1.67
N$107  (via drill 0.35)
  Top 0.3: R51.1 13.1,55.65 v13.1,54.85 | v12.35,52.05 U$45.4 13.3,51.25 17.2,51.25 C26.1
  Bottom 0.3: v13.1,54.85 13.1,52.8 v12.35,52.05
N$108
  Top 0.3: R55.1 14.45,67.5 C28.1 13.6,66.15 U$47.2
N$110
  Top 0.3: AB1.2 15.4,71.55 15.4,69.2 | 15.4,69.2 15.4,67 | 15.4,67 15.4,65.5 | 15.4,65.5 15.4,61.85 15.4,58.3 | 15.4,58.3 15.4,56 R51.2 | 15.4,69.2 R55.2 | U$46.3 15.4,65.5 | 14.55,58.3 15.4,58.3 | C27.2 15.4,67
  Top 0.4: U$48.2 15.4,61.85
  Top 0.6: R53.2 14.55,58.3
N$129
  Top 0.3: U$59.3 17.2,35.75 17.2,36.34 18.05,37.2 26.16,37.2 C34.2
N$131
  Top 0.3: 15.54,31 15.75,30.8 15.75,30.2 U$59.24 | 15.54,31 14.15,31 13.95,30.8 13.95,30.2 U$59.21 | 15.54,31 23.2,31 3,3µH.2 24.2,30 C33.1
N$132
  Top 0.3: 15.54,34.8 15.75,35.01 15.75,35.6 U$59.5 | 15.54,34.8 14.15,34.8 13.95,35.01 13.95,35.6 U$59.8 | 15.54,34.8 18.9,34.8 20.05,35.95 24.35,35.95 3,3µH.1 26.75,36.1 C34.1
N$133  (via drill 0.35)
  Top 0.3: IC2.6 72.05,34.75 R78.1 74.35,34.15 C44.1 v74.55,35.47 | v78.8,38.2 Q5.1
  Bottom 0.3: v74.55,35.47 76.07,35.47 v78.8,38.2
N$135
  Top 0.3: R69.1 8.3,35.35 9.5,36.55 10.35,36.55 10.55,36.34 10.55,35.75 U$59.13
N$136
  Top 0.3: R69.2 C36.1
N$139
  Top 0.3: R66.1 C38.1
N$142
  Top 0.3: U$59.17 11.2,30.2 11.2,30.8 10.99,31 8.55,31 R68.2
N$144
  Top 0.3: C33.2 19.9,28.2 17.12,28.2 U$59.26
N$145  (via drill 0.35)
  Top 0.3: IC2.5 71,34.25 72.65,32.6 R78.2 74.3,32.45 C45.1 74.6,32.15 v74.6,31.1 | v78.8,28.7 Q5.2
  Bottom 0.3: v74.6,31.1 76.4,31.1 v78.8,28.7
N$147
  Top 0.3: INA219#1.1 25.1,24.48 25.1,23.6 24.2,22.7 22.68,22.7 22.57,22.8 21.15,22.8 C40.1
  Top 1: R73.2 22.15,20.66 20.8,22.01 C40.1
N$148
  Top 0.3: C47.1 74.15,30 C005R.P$2 71.6,30.45 71.6,32.8 70.64,33.75 IC2.4
N$150
  Top 0.4: U$57.1 27.7,43.77 27.7,44.61
  Top 0.5: R76.2 23.7,44.65 C41.1
  Top 0.6: R76.2 25.35,45.7 26.61,45.7 27.7,44.61
N$151
  Top 0.3: R77.2 23.7,40.35 C41.2 24.55,41.45 24.55,43.9 25,44.35 26.55,44.35 26.77,44.12 U$57.2
N$152
  Top 0.3: IC2.3 70.3,33.25 71.1,32.45 71.1,29.75 C005R.P$1 73.05,27.8 C46.1
N$159
  Top 0.3: PWR.C 65,21.3 67.75,24.05 R82.2
N$161
  Top 0.3: R81.1 64.43,25.78 63.8,26.41 63.8,29.8 64.34,29.8 64.55,30 IC2.41
NRST  (via drill 0.35)
  Top 0.25: U$23.NRST/EN 53.1,14.07 v53.02,14.15 | v66.4,16.25 69.58,19.43 v75.75,19.43
  Top 0.3: 73.31,35.36 73.2,35.25 IC2.7 | 73.31,35.36 R79.2 | v73.38,35.3 73.31,35.36
  Bottom 0.25: v53.02,14.15 53.82,14.95 57.81,14.95 58.41,14.35 64.5,14.35 v66.4,16.25 | v75.75,19.43 79.45,23.12 79.45,25.18
  Bottom 0.3: 79.45,25.18 73.38,31.25 v73.38,35.3
OC1
  Top 0.3: U$3.2 23.7,53 23.7,54.6 23.4,54.9 23.4,61.4 U$26.5
OC2
  Top 0.3: U$45.2 11.35,53 11.35,54.5 11.1,54.76 11.1,61.4 U$1.5
OC3
  Top 0.3: U$10.2 48.7,53 48.7,54.65 48.4,54.95 48.4,61.4 U$25.5
OC4
  Top 0.3: U$38.2 36.4,53 36.4,54.65 36.1,54.95 36.1,61.4 U$8.5
OC5
  Top 0.3: U$17.2 73.8,53 73.8,54.5 73.4,54.9 73.4,61.4 U$24.5
OC6
  Top 0.3: U$31.2 61.4,53 61.4,54.65 61.1,54.95 61.1,61.4 U$15.5
OD1
  Top 0.3: U$3.1 22.57,54.38 U$26.4
OD2
  Top 0.3: U$45.1 10.57,54.08 10.57,55.1 U$1.4
OD3
  Top 0.3: U$10.1 47.58,54.38 U$25.4
OD4
  Top 0.3: U$38.1 35.27,54.38 U$8.4
OD5
  Top 0.3: U$17.1 72.58,54.38 U$24.4
OD6
  Top 0.3: U$31.1 60.27,54.38 U$15.4
PGOOD1  (via drill 0.35)
  Top 0.25: v64.4,45.17 65.1,44.48 65.1,43.66 65.55,43.21 IC2.18
  Top 0.3: U$59.10 12.57,36.44 12.73,36.6 12.73,37.03 v12.96,37.03 12.01,37.98 v12.01,38.24 | v10.15,37.63 10.07,37.55 LED2.A
  Bottom 0.25: 37.25,45 38.16,45.92 63.65,45.92 v64.4,45.17
  Bottom 0.3: v12.96,37.03 12.96,37.33 15.77,40.14 15.77,43.45 26.31,43.45 27.86,45 37.25,45 | v12.01,38.24 11.4,37.63 v10.15,37.63
PGOOD2  (via drill 0.35)
  Top 0.25: v49.89,39.07 51.35,40.53 v51.35,41.2 | v64.3,43.1 65.05,42.35 IC2.19
  Top 0.3: U$16.10 50.27,28.89 v49.89,28.5 49.89,28.09 49.55,27.75 49.55,26.36 49.76,26.15 51.7,26.15 52.3,26.75 52.3,27.45 52.6,27.75 LED3.A
  Bottom 0.25: v49.89,28.5 v49.89,39.07 | v51.35,41.2 53.27,43.12 64.3,43.12
  Bottom 0.3: 64.3,43.12 v64.3,43.1
RX-C  (via drill 0.35)
  Top 0.3: IC2.31 60.3,34.75 59.44,33.89 v59.31,33.89 | v54.06,19.81 53.75,19.5 U$23.RX0
  Bottom 0.25: v54.06,19.81 54.06,20.04 56.55,22.53 56.55,31.86 58.58,33.89 v59.31,33.89
SCL  (via drill 0.35)
  Top 0.25: 46.8,46.47 61.13,46.47 63.6,44 63.6,42.81 64.05,42.36 64.05,40.2 | AD5272#2.9 39,42.99 38.78,42.78 37.23,42.78 35.45,41 35.45,39.96 34.92,39.42
  Top 0.3: 64.05,40.2 IC2.21 | 33.05,38.92 R101.2 33.81,40.85 35.92,42.96 35.92,44.67 37.72,46.47 46.8,46.47 | 33.05,38.92 33.05,38.87 26.89,38.87 25.17,40.59 | U$57.5 25.17,40.59 | 25.17,40.59 25.08,40.5 v24.64,40.5 | INA219#1.5 22.45,21.9 v22.27,22.07 | 34.92,39.42 34.42,38.92 33.05,38.92
  Bottom 0.3: v24.64,40.5 22.81,38.67 22.81,27.96 21.6,26.75 21.6,22.75 v22.27,22.07
SCLTM
  Top 0.25: 69.75,22.28 69.15,21.68 67.46,21.68 65.46,19.68 62.14,19.68 60.11,21.7 50.29,21.7 49.01,20.43 43.99,20.43 BSK4.5
  Top 0.3: 69.75,23.8 69.75,27.26 68.88,28.13 67.8,28.13 67.32,27.65 65.45,27.65 65.45,28.78 66.05,29.38 66.05,29.5 66.55,30 IC2.45 | 69.75,23.8 69.75,22.28 | 69.75,23.8 71.1,23.8 R25.2
SDA  (via drill 0.35)
  Top 0.25: 34.75,41.08 34.75,41.12 36.4,42.77 36.4,44.43 37.93,45.96 60.69,45.96 63.15,43.5 63.15,42.62 63.55,42.22 63.55,39.7 | 34.75,38.47 35.9,39.62 35.9,40.8 37.43,42.33 38.97,42.33 39.48,42.83 39.48,43.72 AD5272#2.8
  Top 0.3: 63.55,39.7 IC2.22 | v34.75,40.25 34.75,41.08 | INA219#1.6 23.77,21.12 v23.29,20.64 | 34.75,38.47 v34.75,38.2 34.15,37.6 R102.2 32.9,37.6 30.3,35 29.63,35 29.45,34.82 28.52,34.82 28,34.3 v24.45,34.3 | U$57.6 26.2,40.83 26.2,40.3 27.13,39.37 28.1,39.37 28.1,40.05 v28.09,40.07
  Bottom 0.3: v34.75,40.25 v34.75,38.2 | v23.29,20.64 23.29,22.09 22.1,23.28 22.1,26.34 23.31,27.55 23.31,34.65 23.66,34.3 v24.45,34.3 26.21,36.06 26.21,38.2 v28.09,40.07
SDATM  (via drill 0.35)
  Top 0.25: v70.56,22.38 69.41,21.23 67.65,21.23 65.64,19.23 61.96,19.23 59.93,21.25 50.47,21.25 49.19,19.98 44.25,19.98 39.88,15.61
  Top 0.3: 39.88,15.61 39.88,14.74 39.23,14.09 38.31,14.09 37.2,15.2 BSK4.4 | IC2.46 67.05,31.73 70.3,31.73 70.3,25.25 v70.5,25.05 R26.2
  Bottom 0.3: v70.56,22.38 70.46,22.48 70.46,25.01 v70.5,25.05
SWC  (via drill 0.35)
  Top 0.3: R27.2 60.35,27.5 v59.9,27.95 60.49,27.95 61.05,28.5 61.05,29.3 62.5,30.75 IC2.37 | U$23.SWC/TXD 55.75,16.75 56.19,17.19 56.19,19.6 v56.38,19.79
  Bottom 0.25: v56.38,19.79 56.38,20.82 59.9,24.34 v59.9,27.95
SWD  (via drill 0.35)
  Top 0.25: R64.2 57.9,27.36 v58.42,27.88 58.42,28.73 59.27,29.59 59.27,32.38 60.14,33.25 IC2.34
  Top 0.3: v55.3,19.8 55.25,19.75 U$23.SWD/RXD
  Bottom 0.25: v55.3,19.8 55.38,19.88 55.38,20.64 58.42,23.68 v58.42,27.88
TIME
  Top 0.25: 68.65,22.61 67.11,22.61 65.08,20.57 62.52,20.57 60.48,22.61 49.91,22.61 48.63,21.32 43.33,21.32 39.3,17.3
  Top 0.3: BSK4.2 33.25,17.3 39.3,17.3 | 68.65,22.61 68.65,24.93 67.06,24.93 66.5,25.48 66.5,26.34 66.22,26.63 64.31,26.63 64.3,26.64 64.3,29.3 64.55,29.3 65.05,29.8 IC2.42
TX-C  (via drill 0.35)
  Top 0.25: 57.3,19.7 57.3,19.86 56.61,20.55 53.3,20.55 v53.25,20.5
  Top 0.3: IC2.30 59.85,35.25 59.6,35.01 v59.27,35.01 | 57.3,19.7 57.3,16.4 57.25,16.35 U$23.TX0
  Bottom 0.25: v59.27,35.01 59.03,35.01 56.1,32.07 56.1,23.35 v53.25,20.5
VDD  (via drill 0.35)
  Top 0.25: 82.35,47.21 v82.35,46.65 | v32.4,17.55 28.18,17.55 25.45,20.28 v25.45,20.38 | v59.25,16.05 59.29,16.09 59.29,18.82 v60.26,19.79 | v62.15,22.09 v62.16,22.1 63.05,22.1 | v61.75,39.55 62.27,39.02 62.52,39.02 | IC2.1 68.46,32.25 v68.25,32.46 | 61.25,30.59 61.25,30.25 C55.1 59.87,29.2 59.15,28.48
  Top 0.3: R64.1 57.85,24.88 57.85,24.98 59.15,24.98 | 59.15,24.98 R27.1 61.25,25.88 61.25,27.95 61.55,28.25 62.6,28.25 63.3,27.55 63.3,26.13 64.3,25.13 64.3,23.9 63.25,22.85 PB5.A 63.05,22.1 PWR.A | 77.11,39.48 76.94,39.65 75.4,39.65 C48.1 74,38.25 72.55,38.25 | 77.11,39.48 77.15,39.45 77.15,38.16 76.25,37.26 R79.1 | 72.55,38.25 70.55,36.25 IC2.9 68.4,36.25 v68.2,36.45 | AB3.3 66.8,72.69 71.23,72.69 72.2,73.66 72.2,74.26 72.85,74.91 78.85,74.91 82.35,71.41 82.35,47.21 | v78.78,39.58 77.2,39.58 77.11,39.48 | 61.25,30.59 61.25,32.05 IC2.36 61.88,32.25 62.06,32.07 63.09,32.07 63.09,33.18 62.81,33.46 | 59.15,28.48 59.15,24.98 | IC2.48 68.29,30.99 v69.39,30.99 69.39,29.14 C53.1 | U$23.3V3/BUS1 56.75,15.99 v56.5,16.25 | 62.81,33.46 | 62.81,33.46 62.55,33.72 62.55,38.99 62.52,39.02 62.55,39.17 IC2.24 62.55,38.95 62.55,33.73 62.81,33.46 | v54.49,16.32 54.25,16.07 U$23.3V3/BUS0 | v27.85,42.3 29.25,42.3 29.9,42.95 29.8,42.95 29.1,43.65 v28.65,43.65 | R26.1 74.2,25.05 v75.3,23.95 74.15,22.8 R25.1 | R101.1 v30.32,39.82 | v30,37.6 R102.1 | v61.75,39.55 61.75,40.35 C15.1 59,43.1 C16.1 | C54.1 72.55,38.25 | INA219#1.4 23.1,24.52 23.1,25.09 23.5,25.5 v23.5,25.78 | U$57.4 25.28,43.3 v25.28,42.45 26.03,41.7 26.5,41.7 26.77,41.42 U$57.7 | v29.4,34 30.25,34 U$2.P$5
  Bottom 0.25: v82.35,46.65 82.35,43.15 80.84,41.64 | 23.85,29.27 23.85,26.13 v23.5,25.78 | v25.45,20.38 25.35,20.48 24.7,20.48 24.55,20.63 24.52,20.63 23.95,21.2 | v56.5,16.25 59.05,16.25 v59.25,16.05 | v62.15,22.09 62.15,21.68 v60.26,19.79 | 64.15,39.58 61.77,39.58 v61.75,39.55 | v68.25,32.46 68.46,32.25 69.39,32.25
  Bottom 0.3: AB3.3 64.72,73.8 63.61,72.69 45.31,72.69 44.34,73.66 44.34,74.26 43.69,74.91 42.77,74.91 41.66,73.8 AB2.3 39.72,73.8 38.61,72.69 20.31,72.69 19.34,73.66 19.34,74.26 18.69,74.91 17.77,74.91 16.66,73.8 AB1.3 | v56.5,16.25 56.4,16.34 54.52,16.34 v54.49,16.32 49.16,16.32 45.88,13.05 43.42,13.05 41.4,15.07 BSK4.6 41.17,15.3 40.27,15.3 38.02,17.55 v32.4,17.55 | 64.15,39.58 v78.78,39.58 80.84,41.64 | v68.2,36.45 69.39,35.26 69.39,32.25 v69.39,30.99 71.12,29.26 71.12,28.63 71.58,28.17 72.26,28.17 75.3,25.13 v75.3,23.95 | v23.5,25.78 22.6,24.88 22.6,23.48 23.95,22.13 23.95,21.2 | 28.25,35.85 v30,37.6 30.32,37.92 v30.32,39.82 v30.32,39.83 v27.85,42.3 | 28.25,35.85 27.3,35.85 23.85,32.4 23.85,29.27 | v28.65,43.65 27.45,42.45 v25.28,42.45 | v29.4,34 29.4,34.7 29.28,34.82 28.85,34.82 28.42,35.25 28.42,35.68 28.25,35.85
Y  (via drill 0.35)
  Top 0.3: U$16.18 50.85,35.25 50.85,36.28 50.25,36.88 v49.15,36.88 | v34.2,33.9 33.25,33.9 U$2.P$4
  Bottom 0.3: v49.15,36.88 46.95,36.88 46.76,37.08 41.98,37.08 40.45,38.61 38.91,38.61 v34.2,33.9

## Text on the board
tPlace: B-4 | BC4 | VDD | GND | 1W | B-3 | BC3 | B+ | BMS | SDATM | SCLTM | Discharge DC-DC | Charge DC-DC | GND | TIME | INT | SDA | SCL | VDD | BUS+ | 5V
bNames: ARK "Концерн ИТС"
tValues: OFF | ON